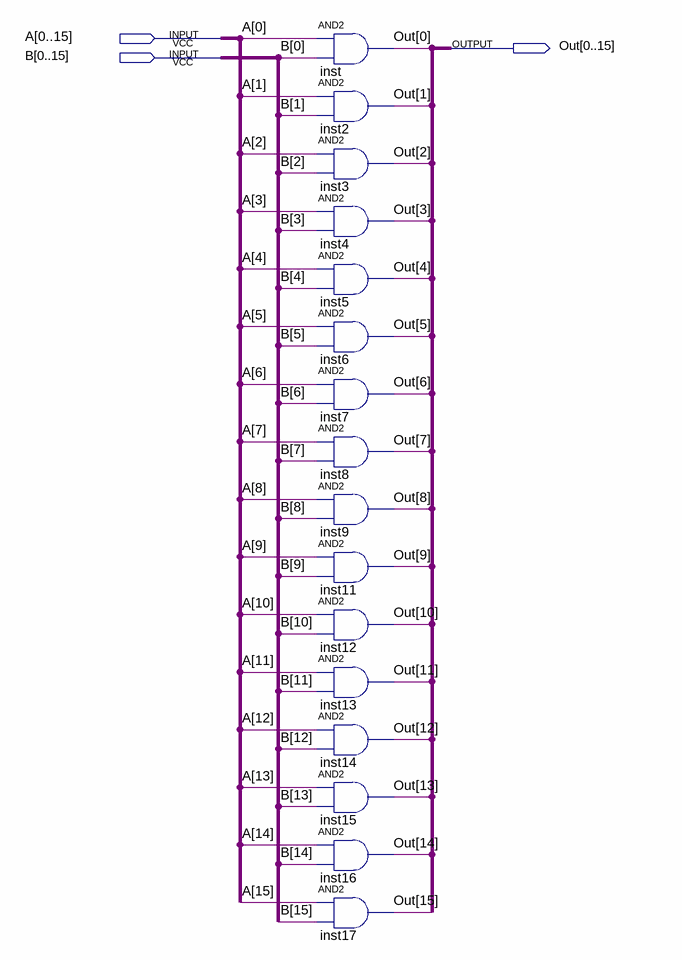
[diagram p0: schematic sheet]
// Quartus schematic and2_bus16.bdf as structural Verilog: 16 symbols, 3 pins
module and2_bus16 (
  input  [0:15] A,
  input  [0:15] B,
  output [0:15] Out
);

  and inst (Out[0], A[0], B[0]);
  and inst2 (Out[1], A[1], B[1]);
  and inst3 (Out[2], A[2], B[2]);
  and inst4 (Out[3], A[3], B[3]);
  and inst5 (Out[4], A[4], B[4]);
  and inst6 (Out[5], A[5], B[5]);
  and inst7 (Out[6], A[6], B[6]);
  and inst8 (Out[7], A[7], B[7]);
  and inst9 (Out[8], A[8], B[8]);
  and inst11 (Out[9], A[9], B[9]);
  and inst12 (Out[10], A[10], B[10]);
  and inst13 (Out[11], A[11], B[11]);
  and inst14 (Out[12], A[12], B[12]);
  and inst15 (Out[13], A[13], B[13]);
  and inst16 (Out[14], A[14], B[14]);
  and inst17 (Out[15], A[15], B[15]);
endmodule
